# EasyEDA schematic LED_Cube_8x8x8_Nano.json
TITLE: LED_Cube_8x8x8_nano; REV: 1.0; Date: 2019-07-24; Sheet: 1/1; Drawn By: sagakusumawijaya; Company: EMTRONICS
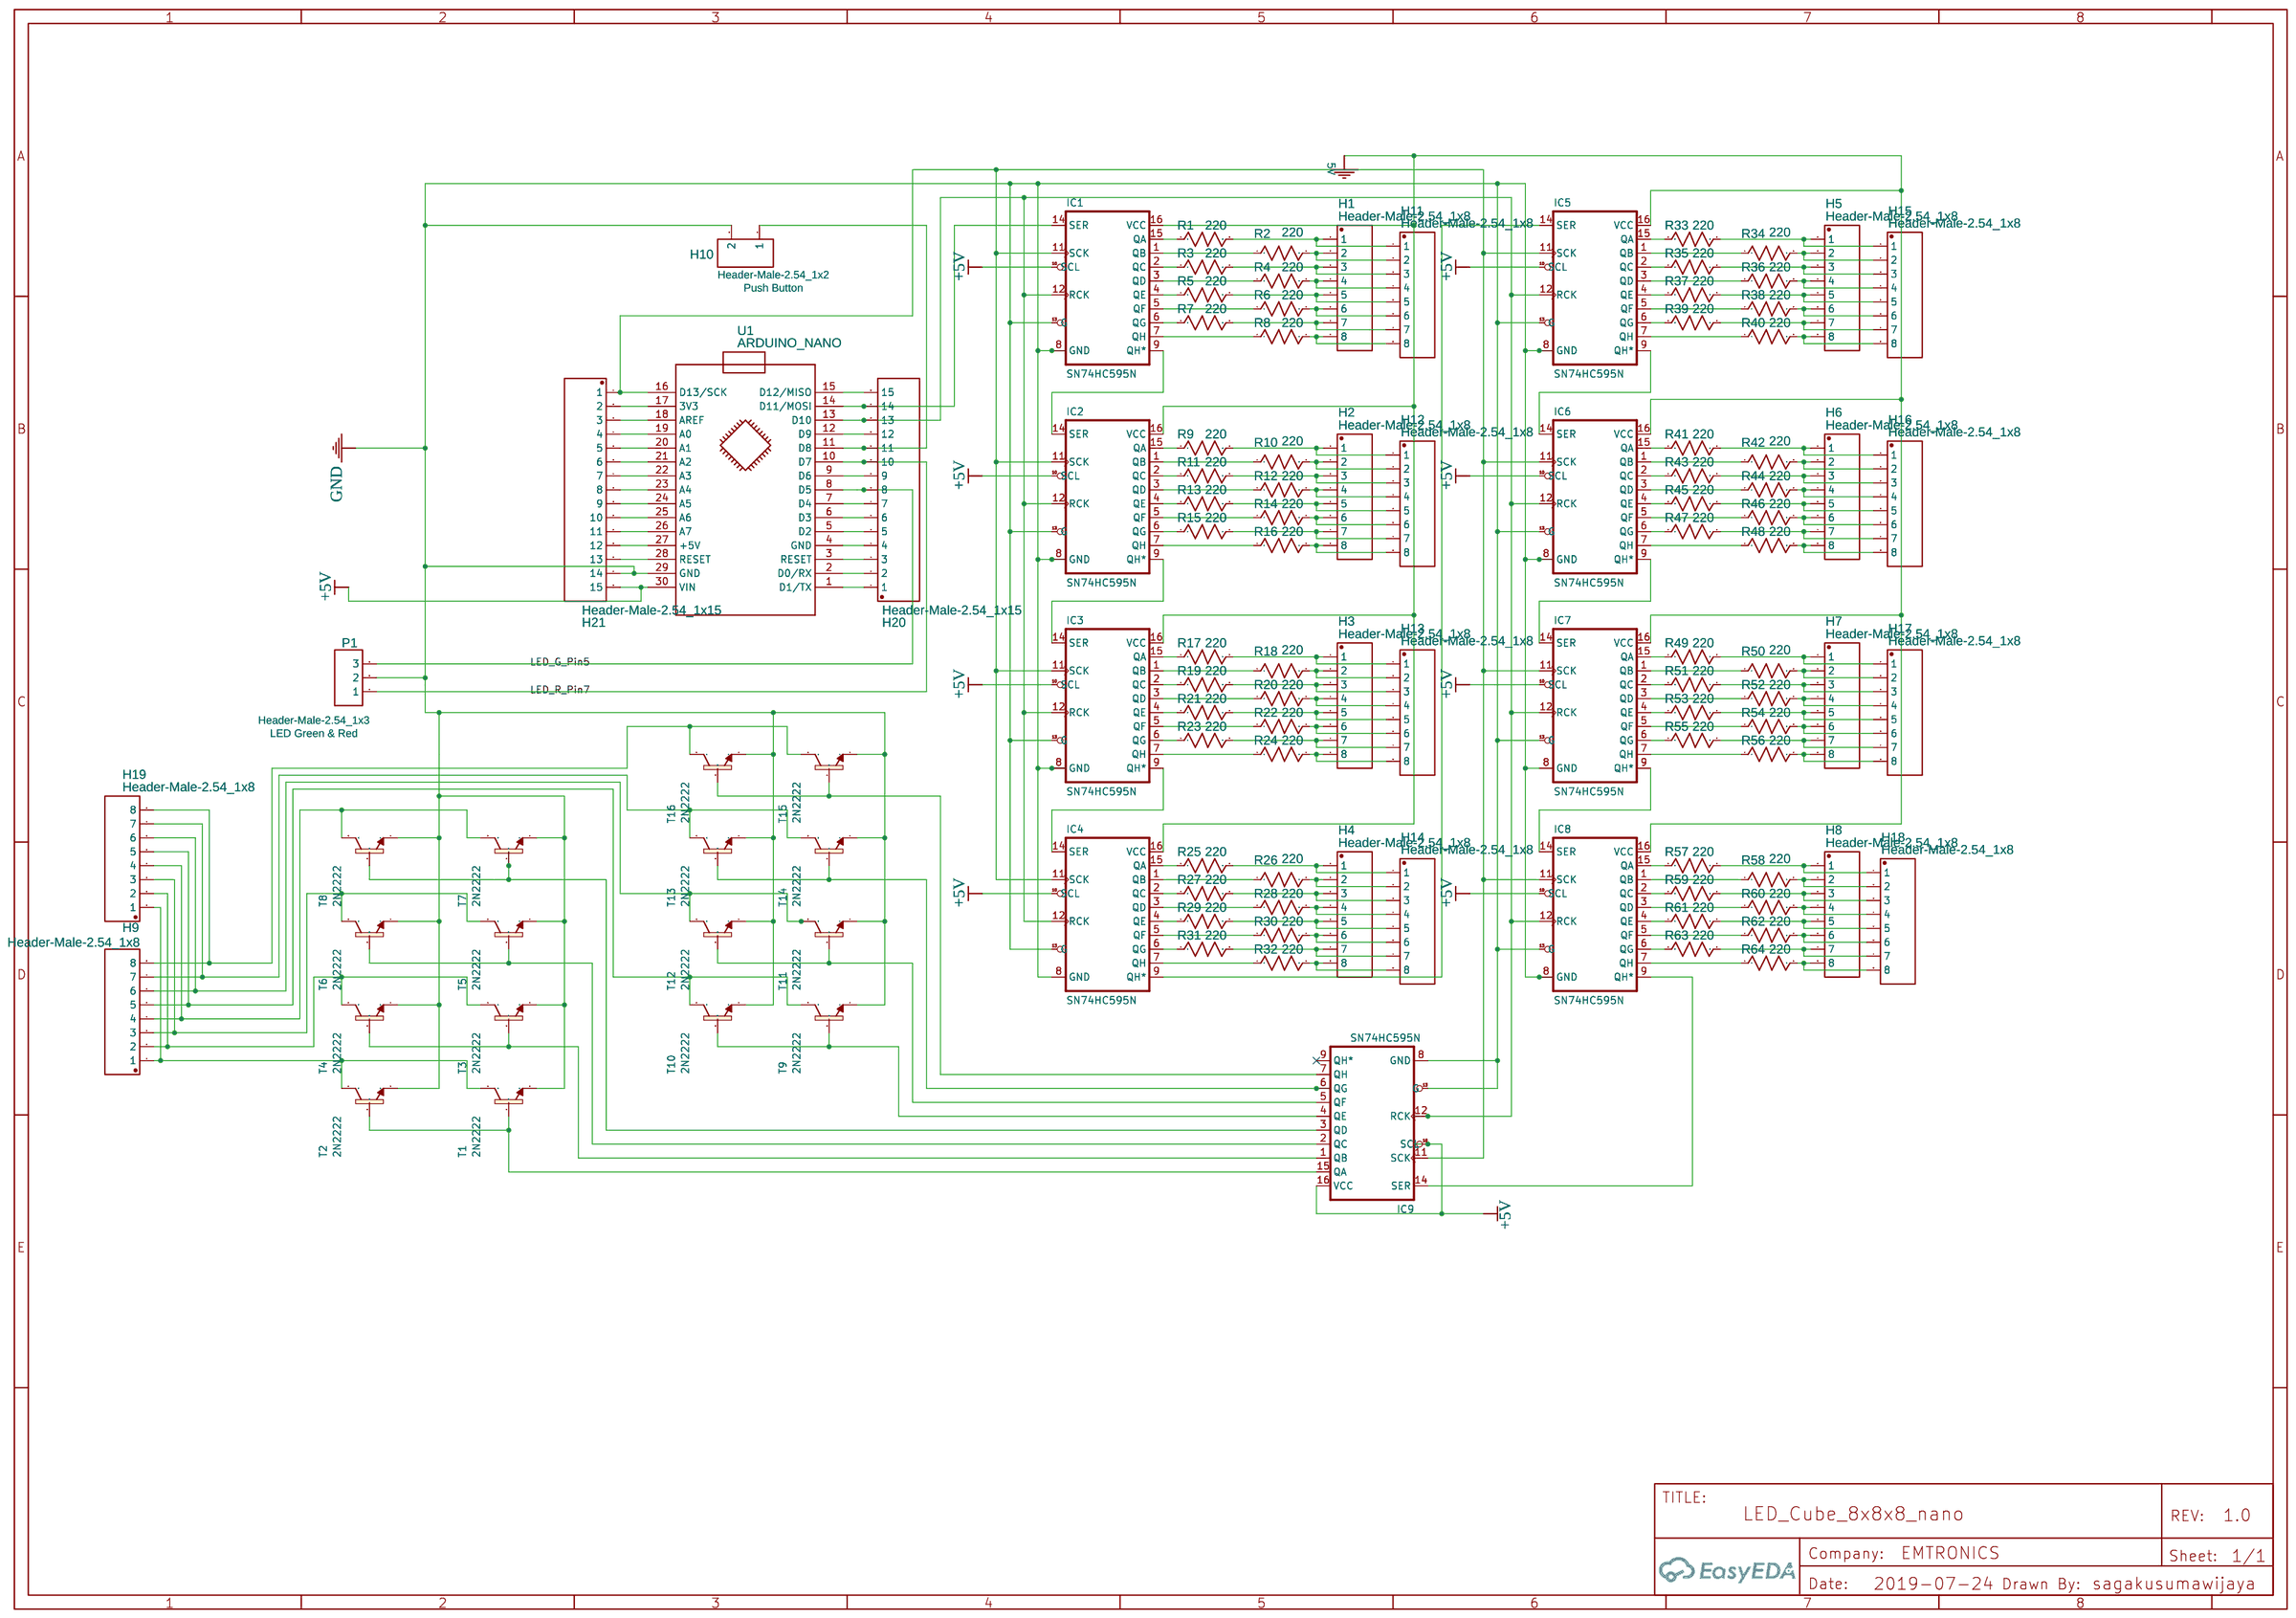
[diagram p0: schematic sheet]

## Parts
H1  Header-Male-2.54_1x8  [210S-1X8P]
H2  Header-Male-2.54_1x8  [210S-1X8P]
H3  Header-Male-2.54_1x8  [210S-1X8P]
H4  Header-Male-2.54_1x8  [210S-1X8P]
H5  Header-Male-2.54_1x8  [210S-1X8P]
H6  Header-Male-2.54_1x8  [210S-1X8P]
H7  Header-Male-2.54_1x8  [210S-1X8P]
H8  Header-Male-2.54_1x8  [210S-1X8P]
H9  Header-Male-2.54_1x8  [210S-1X8P]
H10  Header-Male-2.54_1x2\nPush Button  [HDR-2X1/2.54]
H11  Header-Male-2.54_1x8  [210S-1X8P]
H12  Header-Male-2.54_1x8  [210S-1X8P]
H13  Header-Male-2.54_1x8  [210S-1X8P]
H14  Header-Male-2.54_1x8  [210S-1X8P]
H15  Header-Male-2.54_1x8  [210S-1X8P]
H16  Header-Male-2.54_1x8  [210S-1X8P]
H17  Header-Male-2.54_1x8  [210S-1X8P]
H18  Header-Male-2.54_1x8  [210S-1X8P]
H19  Header-Male-2.54_1x8  [210S-1X8P]
H20  Header-Male-2.54_1x15  [DIP-1X15P-2.54MM-M]
H21  Header-Male-2.54_1x15  [DIP-1X15P-2.54MM-M]
IC1  SN74HC595N  [DIP16]
IC2  SN74HC595N  [DIP16]
IC3  SN74HC595N  [DIP16]
IC4  SN74HC595N  [DIP16]
IC5  SN74HC595N  [DIP16]
IC6  SN74HC595N  [DIP16]
IC7  SN74HC595N  [DIP16]
IC8  SN74HC595N  [DIP16]
IC9  SN74HC595N  [DIP16]
P1  Header-Male-2.54_1x3\nLED Green & Red  [HDR-3X1/2.54]
R1  220  [AXIAL-0.4]
R2  220  [AXIAL-0.4]
R3  220  [AXIAL-0.4]
R4  220  [AXIAL-0.4]
R5  220  [AXIAL-0.4]
R6  220  [AXIAL-0.4]
R7  220  [AXIAL-0.4]
R8  220  [AXIAL-0.4]
R9  220  [AXIAL-0.4]
R10  220  [AXIAL-0.4]
R11  220  [AXIAL-0.4]
R12  220  [AXIAL-0.4]
R13  220  [AXIAL-0.4]
R14  220  [AXIAL-0.4]
R15  220  [AXIAL-0.4]
R16  220  [AXIAL-0.4]
R17  220  [AXIAL-0.4]
R18  220  [AXIAL-0.4]
R19  220  [AXIAL-0.4]
R20  220  [AXIAL-0.4]
R21  220  [AXIAL-0.4]
R22  220  [AXIAL-0.4]
R23  220  [AXIAL-0.4]
R24  220  [AXIAL-0.4]
R25  220  [AXIAL-0.4]
R26  220  [AXIAL-0.4]
R27  220  [AXIAL-0.4]
R28  220  [AXIAL-0.4]
R29  220  [AXIAL-0.4]
R30  220  [AXIAL-0.4]
R31  220  [AXIAL-0.4]
R32  220  [AXIAL-0.4]
R33  220  [AXIAL-0.4]
R34  220  [AXIAL-0.4]
R35  220  [AXIAL-0.4]
R36  220  [AXIAL-0.4]
R37  220  [AXIAL-0.4]
R38  220  [AXIAL-0.4]
R39  220  [AXIAL-0.4]
R40  220  [AXIAL-0.4]
R41  220  [AXIAL-0.4]
R42  220  [AXIAL-0.4]
R43  220  [AXIAL-0.4]
R44  220  [AXIAL-0.4]
R45  220  [AXIAL-0.4]
R46  220  [AXIAL-0.4]
R47  220  [AXIAL-0.4]
R48  220  [AXIAL-0.4]
R49  220  [AXIAL-0.4]
R50  220  [AXIAL-0.4]
R51  220  [AXIAL-0.4]
R52  220  [AXIAL-0.4]
R53  220  [AXIAL-0.4]
R54  220  [AXIAL-0.4]
R55  220  [AXIAL-0.4]
R56  220  [AXIAL-0.4]
R57  220  [AXIAL-0.4]
R58  220  [AXIAL-0.4]
R59  220  [AXIAL-0.4]
R60  220  [AXIAL-0.4]
R61  220  [AXIAL-0.4]
R62  220  [AXIAL-0.4]
R63  220  [AXIAL-0.4]
R64  220  [AXIAL-0.4]
T1  2N2222  [TO92-EBC-OVAL]
T2  2N2222  [TO92-EBC-OVAL]
T3  2N2222  [TO92-EBC-OVAL]
T4  2N2222  [TO92-EBC-OVAL]
T5  2N2222  [TO92-EBC-OVAL]
T6  2N2222  [TO92-EBC-OVAL]
T7  2N2222  [TO92-EBC-OVAL]
T8  2N2222  [TO92-EBC-OVAL]
T9  2N2222  [TO92-EBC-OVAL]
T10  2N2222  [TO92-EBC-OVAL]
T11  2N2222  [TO92-EBC-OVAL]
T12  2N2222  [TO92-EBC-OVAL]
T13  2N2222  [TO92-EBC-OVAL]
T14  2N2222  [TO92-EBC-OVAL]
T15  2N2222  [TO92-EBC-OVAL]
T16  2N2222  [TO92-EBC-OVAL]
U1  ARDUINO_NANO  [ARDUINO_NANO]

## Library data of the parts
H1-H9 H11-H19 = -: Supplier: LCSC; Manufacturer: Ckmtw; Manufacturer Part: 210S-1*8P L=11.6MMGold-plated black; Contributor: LCSC; Supplier Part: C124381
H10 = -: Supplier: LCSC; Manufacturer: TE Connectivity; Manufacturer Part: 826629-2; image: //image.lceda.cn/szlcsc/C86471.jpg; Supplier Part: C86471
H20 H21 = -: Supplier: LCSC; Manufacturer: Ckmtw; Manufacturer Part: 210S-1*15P L=11.6MMGold-plated black; Contributor: LCSC; Supplier Part: C124373
P1 = -: Supplier: LCSC; Manufacturer: BOOMELE; Manufacturer Part: Header2.54mm 1*3P; image: //image.lceda.cn/szlcsc/C49257.jpg; Supplier Part: C49257
R1-R64 = Res_AXIAL-0.4(1/4W)_US: Manufacturer Part: ?
U1 = -: sourceId: KGSeAWhDB; Manufacturer Part: ?

## Nets
5V: IC1.16(VCC) IC2.16(VCC) IC3.16(VCC) IC4.16(VCC) IC5.16(VCC) IC6.16(VCC) IC7.16(VCC) IC8.16(VCC)
+5V: H21.15 IC1.10(SCL) IC2.10(SCL) IC3.10(SCL) IC4.10(SCL) IC5.10(SCL) IC6.10(SCL) IC7.10(SCL) IC8.10(SCL) IC9.10(SCL) IC9.16(VCC) U1.30(VIN)
GND: H10.2 H21.14 IC1.8(GND) IC1.13(G) IC2.8(GND) IC2.13(G) IC3.8(GND) IC3.13(G) IC4.8(GND) IC4.13(G) IC5.8(GND) IC5.13(G) IC6.8(GND) IC6.13(G) IC7.8(GND) IC7.13(G) IC8.8(GND) IC8.13(G) IC9.8(GND) IC9.13(G) P1.2 T1.E T2.E T3.E T4.E T5.E T6.E T7.E T8.E T9.E T10.E T11.E T12.E T13.E T14.E T15.E T16.E U1.29(GND)
LED_G_Pin5: H20.8 P1.3 U1.8(D5)
LED_R_Pin7: H20.10 P1.1 U1.10(D7)
Net-(H1-1): H1.1 H11.1 R1.2
Net-(H1-2): H1.2 H11.2 R2.2
Net-(H1-3): H1.3 H11.3 R3.2
Net-(H1-4): H1.4 H11.4 R4.2
Net-(H1-5): H1.5 H11.5 R5.2
Net-(H1-6): H1.6 H11.6 R6.2
Net-(H1-7): H1.7 H11.7 R7.2
Net-(H1-8): H1.8 H11.8 R8.2
Net-(H2-1): H2.1 H12.1 R9.2
Net-(H2-2): H2.2 H12.2 R10.2
Net-(H2-3): H2.3 H12.3 R11.2
Net-(H2-4): H2.4 H12.4 R12.2
Net-(H2-5): H2.5 H12.5 R13.2
Net-(H2-6): H2.6 H12.6 R14.2
Net-(H2-7): H2.7 H12.7 R15.2
Net-(H2-8): H2.8 H12.8 R16.2
Net-(H3-1): H3.1 H13.1 R17.2
Net-(H3-2): H3.2 H13.2 R18.2
Net-(H3-3): H3.3 H13.3 R19.2
Net-(H3-4): H3.4 H13.4 R20.2
Net-(H3-5): H3.5 H13.5 R21.2
Net-(H3-6): H3.6 H13.6 R22.2
Net-(H3-7): H3.7 H13.7 R23.2
Net-(H3-8): H3.8 H13.8 R24.2
Net-(H4-1): H4.1 H14.1 R25.2
Net-(H4-2): H4.2 H14.2 R26.2
Net-(H4-3): H4.3 H14.3 R27.2
Net-(H4-4): H4.4 H14.4 R28.2
Net-(H4-5): H4.5 H14.5 R29.2
Net-(H4-6): H4.6 H14.6 R30.2
Net-(H4-7): H4.7 H14.7 R31.2
Net-(H4-8): H4.8 H14.8 R32.2
Net-(H5-1): H5.1 H15.1 R33.2
Net-(H5-2): H5.2 H15.2 R34.2
Net-(H5-3): H5.3 H15.3 R35.2
Net-(H5-4): H5.4 H15.4 R36.2
Net-(H5-5): H5.5 H15.5 R37.2
Net-(H5-6): H5.6 H15.6 R38.2
Net-(H5-7): H5.7 H15.7 R39.2
Net-(H5-8): H5.8 H15.8 R40.2
Net-(H6-1): H6.1 H16.1 R41.2
Net-(H6-2): H6.2 H16.2 R42.2
Net-(H6-3): H6.3 H16.3 R43.2
Net-(H6-4): H6.4 H16.4 R44.2
Net-(H6-5): H6.5 H16.5 R45.2
Net-(H6-6): H6.6 H16.6 R46.2
Net-(H6-7): H6.7 H16.7 R47.2
Net-(H6-8): H6.8 H16.8 R48.2
Net-(H7-1): H7.1 H17.1 R49.2
Net-(H7-2): H7.2 H17.2 R50.2
Net-(H7-3): H7.3 H17.3 R51.2
Net-(H7-4): H7.4 H17.4 R52.2
Net-(H7-5): H7.5 H17.5 R53.2
Net-(H7-6): H7.6 H17.6 R54.2
Net-(H7-7): H7.7 H17.7 R55.2
Net-(H7-8): H7.8 H17.8 R56.2
Net-(H8-1): H8.1 H18.1 R57.2
Net-(H8-2): H8.2 H18.2 R58.2
Net-(H8-3): H8.3 H18.3 R59.2
Net-(H8-4): H8.4 H18.4 R60.2
Net-(H8-5): H8.5 H18.5 R61.2
Net-(H8-6): H8.6 H18.6 R62.2
Net-(H8-7): H8.7 H18.7 R63.2
Net-(H8-8): H8.8 H18.8 R64.2
Net-(H9-1): H9.1 H19.1 T1.C T2.C
Net-(H9-2): H9.2 H19.2 T3.C T4.C
Net-(H9-3): H9.3 H19.3 T5.C T6.C
Net-(H9-4): H9.4 H19.4 T7.C T8.C
Net-(H9-5): H9.5 H19.5 T9.C T10.C
Net-(H9-6): H9.6 H19.6 T11.C T12.C
Net-(H9-7): H9.7 H19.7 T13.C T14.C
Net-(H9-8): H9.8 H19.8 T15.C T16.C
Net-(H10-1): H10.1 H20.11 U1.11(D8)
Net-(H20-1): H20.1 U1.1(D1/TX)
Net-(H20-2): H20.2 U1.2(D0/RX)
Net-(H20-3): H20.3 U1.3(RESET)
Net-(H20-4): H20.4 U1.4(GND)
Net-(H20-5): H20.5 U1.5(D2)
Net-(H20-6): H20.6 U1.6(D3)
Net-(H20-7): H20.7 U1.7(D4)
Net-(H20-9): H20.9 U1.9(D6)
Net-(H20-12): H20.12 U1.12(D9)
Net-(H20-13): H20.13 IC1.12(RCK) IC2.12(RCK) IC3.12(RCK) IC4.12(RCK) IC5.12(RCK) IC6.12(RCK) IC7.12(RCK) IC8.12(RCK) IC9.12(RCK) U1.13(D10)
Net-(H20-14): H20.14 IC1.14(SER) U1.14(D11/MOSI)
Net-(H20-15): H20.15 U1.15(D12/MISO)
Net-(H21-1): H21.1 IC1.11(SCK) IC2.11(SCK) IC3.11(SCK) IC4.11(SCK) IC5.11(SCK) IC6.11(SCK) IC7.11(SCK) IC8.11(SCK) IC9.11(SCK) U1.16(D13/SCK)
Net-(H21-2): H21.2 U1.17(3V3)
Net-(H21-3): H21.3 U1.18(AREF)
Net-(H21-4): H21.4 U1.19(A0)
Net-(H21-5): H21.5 U1.20(A1)
Net-(H21-6): H21.6 U1.21(A2)
Net-(H21-7): H21.7 U1.22(A3)
Net-(H21-8): H21.8 U1.23(A4)
Net-(H21-9): H21.9 U1.24(A5)
Net-(H21-10): H21.10 U1.25(A6)
Net-(H21-11): H21.11 U1.26(A7)
Net-(H21-12): H21.12 U1.27(+5V)
Net-(H21-13): H21.13 U1.28(RESET)
Net-(IC1-1): IC1.1(QB) R2.1
Net-(IC1-2): IC1.2(QC) R3.1
Net-(IC1-3): IC1.3(QD) R4.1
Net-(IC1-4): IC1.4(QE) R5.1
Net-(IC1-5): IC1.5(QF) R6.1
Net-(IC1-6): IC1.6(QG) R7.1
Net-(IC1-7): IC1.7(QH) R8.1
Net-(IC1-9): IC1.9(QH*) IC2.14(SER)
Net-(IC1-15): IC1.15(QA) R1.1
Net-(IC2-1): IC2.1(QB) R10.1
Net-(IC2-2): IC2.2(QC) R11.1
Net-(IC2-3): IC2.3(QD) R12.1
Net-(IC2-4): IC2.4(QE) R13.1
Net-(IC2-5): IC2.5(QF) R14.1
Net-(IC2-6): IC2.6(QG) R15.1
Net-(IC2-7): IC2.7(QH) R16.1
Net-(IC2-9): IC2.9(QH*) IC3.14(SER)
Net-(IC2-15): IC2.15(QA) R9.1
Net-(IC3-1): IC3.1(QB) R18.1
Net-(IC3-2): IC3.2(QC) R19.1
Net-(IC3-3): IC3.3(QD) R20.1
Net-(IC3-4): IC3.4(QE) R21.1
Net-(IC3-5): IC3.5(QF) R22.1
Net-(IC3-6): IC3.6(QG) R23.1
Net-(IC3-7): IC3.7(QH) R24.1
Net-(IC3-9): IC3.9(QH*) IC4.14(SER)
Net-(IC3-15): IC3.15(QA) R17.1
Net-(IC4-1): IC4.1(QB) R26.1
Net-(IC4-2): IC4.2(QC) R27.1
Net-(IC4-3): IC4.3(QD) R28.1
Net-(IC4-4): IC4.4(QE) R29.1
Net-(IC4-5): IC4.5(QF) R30.1
Net-(IC4-6): IC4.6(QG) R31.1
Net-(IC4-7): IC4.7(QH) R32.1
Net-(IC4-9): IC4.9(QH*) IC5.14(SER)
Net-(IC4-15): IC4.15(QA) R25.1
Net-(IC5-1): IC5.1(QB) R34.1
Net-(IC5-2): IC5.2(QC) R35.1
Net-(IC5-3): IC5.3(QD) R36.1
Net-(IC5-4): IC5.4(QE) R37.1
Net-(IC5-5): IC5.5(QF) R38.1
Net-(IC5-6): IC5.6(QG) R39.1
Net-(IC5-7): IC5.7(QH) R40.1
Net-(IC5-9): IC5.9(QH*) IC6.14(SER)
Net-(IC5-15): IC5.15(QA) R33.1
Net-(IC6-1): IC6.1(QB) R42.1
Net-(IC6-2): IC6.2(QC) R43.1
Net-(IC6-3): IC6.3(QD) R44.1
Net-(IC6-4): IC6.4(QE) R45.1
Net-(IC6-5): IC6.5(QF) R46.1
Net-(IC6-6): IC6.6(QG) R47.1
Net-(IC6-7): IC6.7(QH) R48.1
Net-(IC6-9): IC6.9(QH*) IC7.14(SER)
Net-(IC6-15): IC6.15(QA) R41.1
Net-(IC7-1): IC7.1(QB) R50.1
Net-(IC7-2): IC7.2(QC) R51.1
Net-(IC7-3): IC7.3(QD) R52.1
Net-(IC7-4): IC7.4(QE) R53.1
Net-(IC7-5): IC7.5(QF) R54.1
Net-(IC7-6): IC7.6(QG) R55.1
Net-(IC7-7): IC7.7(QH) R56.1
Net-(IC7-9): IC7.9(QH*) IC8.14(SER)
Net-(IC7-15): IC7.15(QA) R49.1
Net-(IC8-1): IC8.1(QB) R58.1
Net-(IC8-2): IC8.2(QC) R59.1
Net-(IC8-3): IC8.3(QD) R60.1
Net-(IC8-4): IC8.4(QE) R61.1
Net-(IC8-5): IC8.5(QF) R62.1
Net-(IC8-6): IC8.6(QG) R63.1
Net-(IC8-7): IC8.7(QH) R64.1
Net-(IC8-9): IC8.9(QH*) IC9.14(SER)
Net-(IC8-15): IC8.15(QA) R57.1
Net-(IC9-1): IC9.1(QB) T3.B T4.B
Net-(IC9-2): IC9.2(QC) T5.B T6.B
Net-(IC9-3): IC9.3(QD) T7.B T8.B
Net-(IC9-4): IC9.4(QE) T9.B T10.B
Net-(IC9-5): IC9.5(QF) T11.B T12.B
Net-(IC9-6): IC9.6(QG) T13.B T14.B
Net-(IC9-7): IC9.7(QH) T15.B T16.B
Net-(IC9-15): IC9.15(QA) T1.B T2.B

Not connected (* = marked no-connect by the designer): IC9 9(QH*)*
